# Altium project PCB_Personal_Gif.PrjPcb (part 1 of 2)
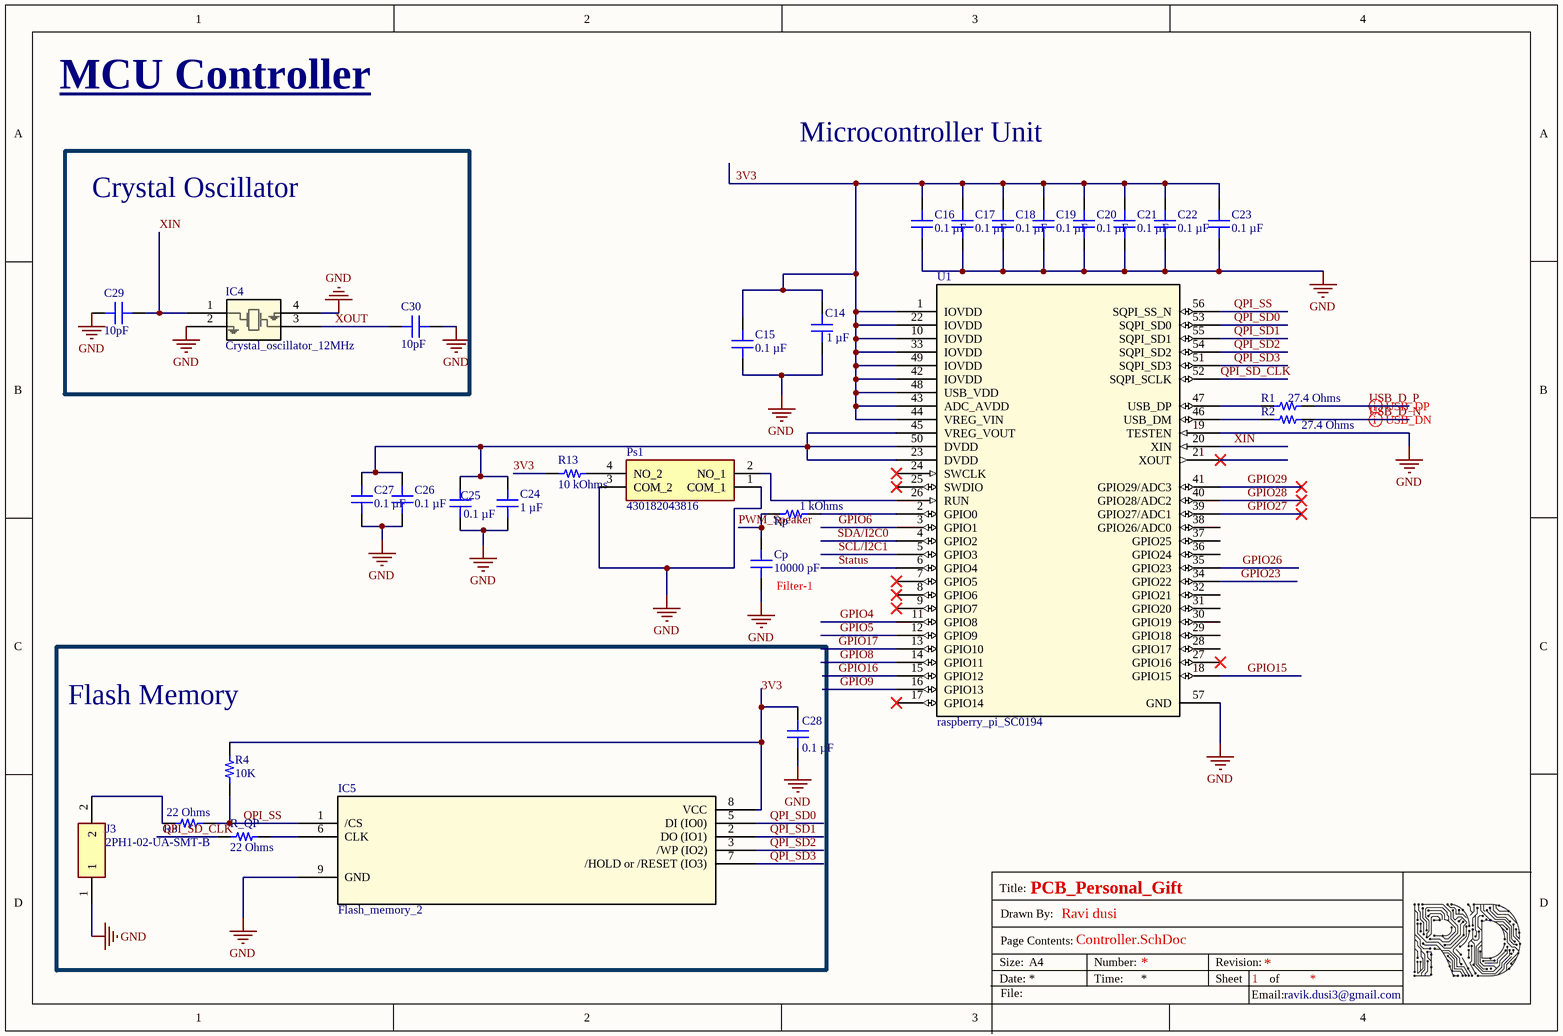
[diagram p0: Controller.SchDoc]
4 sheets, 130 parts. Net scope: global (net labels, ports and power ports of the same name join across sheets).
Board file: GIF_PCB.PcbDoc
Sheets:
  Controller.SchDoc
  Peripherals_1.SchDoc
  Peripherals_2.SchDoc
  Power_Architecture.SchDoc

## Sheet Controller.SchDoc: PCB_Personal_Gift
size A4; Author: Ravi kumar dusi; DrawnBy: Ravi dusi; Engineer: Ravi dusi; SheetNumber: 1; SheetTotal: 4

### Parts
C14  1 µF  [CAP 0402_1005]
C15  0.1 µF  [CAP 0402_1005]
C16  0.1 µF  [CAP 0402_1005]
C17  0.1 µF  [CAP 0402_1005]
C18  0.1 µF  [CAP 0402_1005]
C19  0.1 µF  [CAP 0402_1005]
C20  0.1 µF  [CAP 0402_1005]
C21  0.1 µF  [CAP 0402_1005]
C22  0.1 µF  [CAP 0402_1005]
C23  0.1 µF  [CAP 0402_1005]
C24  1 µF  [CAP 0402_1005]
C25  0.1 µF  [CAP 0402_1005]
C26  0.1 µF  [CAP 0402_1005]
C27  0.1 µF  [CAP 0402_1005]
C28  0.1 µF  [CAP 0402_1005]
C29  10pF  [CAP 0402_1005]
C30  10pF  [CAP 0402_1005]
Cp  10000 pF  [CAP 0402_1005]
IC4  Crystal_oscillator_12MHz  [ABM8-272-T3_ABR]
IC5  Flash_memory_2  [SON127P610X510X80-8N430X340]
J3  2PH1-02-UA-SMT-B  [2PH102UASMTB]
Ps1  430182043816  [430182043816]
R1  27.4 Ohms  [RES 0402_1005]
R2  27.4 Ohms  [RES 0402_1005]
R3  22 Ohms  [RES 0402_1005]
R4  10K  [RES 0402_1005]
R13  10 kOhms  [RES 0402_1005]
R_QP  22 Ohms  [RES 0402_1005]
Rp  1 kOhms  [YAGEO RES 0402_1005]
U1  raspberry_pi_SC0194  [QFN56_7X7_RPI]

### Blocks framed on the sheet
Crystal Oscillator: C29 C30 IC4
Flash Memory: C28 IC5 J3 R3 R4 R_QP

### Nets
GND: C14.1 C15.1 C16.1 C17.1 C18.1 C19.1 C20.1 C21.1 C22.1 C23.1 C24.1 C25.1 C26.1 C27.1 C28.1 C29.1 C30.2 Cp.1 IC4.2 IC4.4 IC5.9(GND) J3.1 Ps1.1(COM_1) Ps1.3(COM_2) U1.19(TESTEN) U1.57(GND)
3V3: C14.2 C15.2 C16.2 C17.2 C18.2 C19.2 C20.2 C21.2 C22.2 C23.2 C28.2 IC5.8(VCC) R4.2 R13.1 U1.1(IOVDD) U1.10(IOVDD) U1.22(IOVDD) U1.33(IOVDD) U1.42(IOVDD) U1.43(ADC_AVDD) U1.44(VREG_VIN) U1.48(USB_VDD) U1.49(IOVDD)
GPIO4: U1.11(GPIO8)
GPIO5: U1.12(GPIO9)
GPIO6: U1.3(GPIO1)
GPIO8: U1.14(GPIO11)
GPIO9: U1.16(GPIO13)
GPIO15: U1.18(GPIO15)
GPIO16: U1.15(GPIO12)
GPIO17: U1.13(GPIO10)
GPIO23: U1.34(GPIO22)
GPIO26: U1.35(GPIO23)
GPIO27: U1.39(GPIO27/ADC1)
GPIO28: U1.40(GPIO28/ADC2)
GPIO29: U1.41(GPIO29/ADC3)
PWM_Speaker: Cp.2 Rp.1
QPI_SD0: IC5.5(DI_(IO0)) U1.53(SQPI_SD0)
QPI_SD1: IC5.2(DO_(IO1)) U1.55(SQPI_SD1)
QPI_SD2: IC5.3(/WP_(IO2)) U1.54(SQPI_SD2)
QPI_SD3: IC5.7(/HOLD_or_/RESET_(IO3)) U1.51(SQPI_SD3)
QPI_SD_CLK: R_QP.1 U1.52(SQPI_SCLK)
QPI_SS: IC5.1(/CS) R3.2 R4.1 U1.56(SQPI_SS_N)
SCL/I2C1: U1.5(GPIO3)
SDA/I2C0: U1.4(GPIO2)
Status: U1.6(GPIO4)
USB_D_N: R2.2
USB_D_P: R1.2
XIN: C29.2 IC4.1 U1.20(XIN)
XOUT: C30.1 IC4.3
NetC24_2: C24.2 C25.2 C26.2 C27.2 U1.23(DVDD) U1.45(VREG_VOUT) U1.50(DVDD)
NetIC5_6: IC5.6(CLK) R_QP.2
NetJ3_2: J3.2 R3.1
NetPs1_2: Ps1.2(NO_1) U1.26(RUN)
NetPs1_4: Ps1.4(NO_2) R13.2
NetR1_1: R1.1 U1.47(USB_DP)
NetR2_1: R2.1 U1.46(USB_DM)
NetRp_2: Rp.2 U1.2(GPIO0)

Not connected (* = marked no-connect by the designer): U1 7(GPIO5)* 8(GPIO6)* 9(GPIO7)* 17(GPIO14)* 21(XOUT)* 24(SWCLK)* 25(SWDIO)* 27(GPIO16)* 28(GPIO17) 29(GPIO18) 30(GPIO19) 31(GPIO20) 32(GPIO21) 36(GPIO24) 37(GPIO25) 38(GPIO26/ADC0)

### Layout directives
differential pair: USB_D_N, USB_D_P

### Notes on the sheet
- MCU Controller
- Microcontroller Unit
- (near Cp) Filter-1
- Title:
- Drawn By:
- Size:
- Date:
- File:
- Page Contents:
- A4
- Number:
- Time:
- Revision:
- Sheet
- Email:
- of
- ravik.dusi3@gmail.com

### Library data of the parts
C14 C24 = GRM155C71A105KE11D: CAP CER 1UF 10V X7S 0402; manufacturer: Murata Electronics; Tolerance: ±10%; Part Number: GRM155C71A105KE11D; Value: 1 µF; Applications: General Purpose; Capacitance: 1 µF; componentlink1description: Datasheet; componentlink1url: https://search.murata.co.jp/Ceramy/image/img/A01X/G101/ENG/GRM155C71A105KE11-01.pdf; componentlink2description: DigiKey Link; componentlink2url: https://www.digikey.com/en/products/detail/murata-electronics/GRM155C71A105KE11D/6606086; Device Package: 0402 (1005 Metric); lastupdated: 09/02/2024 20:04:38; Lifecycle Status: Active; Minimum Order: 1; Mounting Type: Surface Mount, MLCC; Operating Temperature: -55°C ~ 125°C; Package / Case: 0402 (1005 Metric); packaging: TapeAndReel; partid: 1749; Part Status: Active; price: 0.01; series: GRM; Size / Dimension: 0.039" L x 0.020" W (1.00mm x 0.50mm); Supplier 1: DigiKey; Supplier Part Number 1: 490-14457-1-ND; Temperature Coefficient: X7S; Thickness (Max): 0.024" (0.60mm); Voltage - Rated: 10V
C15-C23 C25-C28 = C0402C104K4RECAUTO: CAP CER 0402 0.1UF 16V X7R 10%; manufacturer: KEMET; Part Number: C0402C104K4RECAUTO; Value: 0.1 µF; Applications: Automotive, ESD Protection; Capacitance: 0.1 µF; componentlink1description: Datasheet; componentlink1url: https://api.kemet.com/component-edge/download/datasheet/C0402C104K4RECAUTO.pdf; componentlink2description: DigiKey Link; componentlink2url: https://www.digikey.com/en/products/detail/kemet/C0402C104K4RECAUTO/8563695; Device Package: 0402 (1005 Metric); lastupdated: 09/02/2024 20:04:38; Lifecycle Status: Active; Minimum Order: 1; Mounting Type: Surface Mount, MLCC; Operating Temperature: -55°C ~ 125°C; Package / Case: 0402 (1005 Metric); packaging: TapeAndReel; partid: 1731; Part Status: Active; price: 0.01; Ratings: AEC-Q200; series: ESD SMD Auto X7R; Size / Dimension: 0.039" L x 0.020" W (1.00mm x 0.50mm); Supplier 1: DigiKey; Supplier Part Number 1: 399-17167-1-ND; Temperature Coefficient: X7R; Thickness (Max): 0.022" (0.55mm); Tolerance: ±10%; Voltage - Rated: 16V
C29 C30 = 04025U100JAT2A: CAP CER 10PF 50V C0G/NP0 0402; manufacturer: AVX Corporation; Temperature Coefficient: C0G, NP0; Tolerance: ±5%; Part Number: 04025U100JAT2A; Value: 10pF; Applications: RF, Microwave, High Frequency; Capacitance: 10pF; componentlink1description: Datasheet; componentlink1url: http://datasheets.avx.com/U-Series.pdf; componentlink2description: DigiKey Link; componentlink2url: http://digikey.com/product-detail/en/avx-corporation/04025U100JAT2A/478-3831-1-ND/1118493; Device Package: 0402 (1005 Metric); Features: Ultra Low ESR; lastupdated: 08/02/2022 12:26:58; Lifecycle Status: Active; Minimum Order: 1; Mounting Type: Surface Mount, MLCC; Operating Temperature: -55°C ~ 125°C; Package / Case: 0402 (1005 Metric); packaging: TapeAndReel; partid: 1802; Part Status: Active; price: 0.02; series: U; Size / Dimension: 0.039" L x 0.020" W (1.00mm x 0.50mm); Supplier 1: DigiKey; Supplier Part Number 1: 478-3831-1-ND; Thickness (Max): 0.024" (0.60mm); Voltage - Rated: 50V
Cp = C0402C103M5RECAUTO: CAP CER 0402 10NF 50V X7R 20%; manufacturer: KEMET; Part Number: C0402C103M5RECAUTO; Capacitance: 10000 pF; Applications: Automotive, ESD Protection; componentlink1description: Datasheet; componentlink1url: https://api.kemet.com/component-edge/download/datasheet/C0402C103M5RECAUTO.pdf; componentlink2description: DigiKey Link; componentlink2url: https://www.digikey.com/en/products/detail/kemet/C0402C103M5RECAUTO/8646509; Device Package: 0402 (1005 Metric); lastupdated: 09-02-2024 20:04:13; Lifecycle Status: Active; Minimum Order: 1; Mounting Type: Surface Mount, MLCC; Operating Temperature: -55°C ~ 125°C; Package / Case: 0402 (1005 Metric); packaging: TapeAndReel; partid: 33125; Part Status: Active; price: 0.01; Ratings: AEC-Q200; series: ESD SMD Auto X7R; Size / Dimension: 0.039" L x 0.020" W (1.00mm x 0.50mm); Supplier 1: DigiKey; Supplier Part Number 1: 399-C0402C103M5RECAUTOCT-ND; Temperature Coefficient: X7R; Thickness (Max): 0.022" (0.55mm); Tolerance: ±20%; value: 10000 pF; Voltage - Rated: 50V
IC5 = Flash_memory_2: FLASH - NOR Memory IC 128Mb (16M x 8) SPI - Quad I/O, QPI, DTR 133 MHz 8-SOIC
J3 = 2PH1-02-UA-SMT-B: Connector; Manufacturer_Name: Adam Tech; Datasheet Link: https://datasheet.datasheetarchive.com/originals/distributors/Datasheets_SAMA/9f680ad2dadff3b0200287e04b69ceab.pdf; Height: 6.7mm; Manufacturer_Part_Number: 2PH1-02-UA-SMT-B; Mouser Part Number: 737-2PH1-02-UA-SMT-B; Mouser Price/Stock: https://www.mouser.co.uk/ProductDetail/Adam-Tech/2PH1-02-UA-SMT-B?qs=HoCaDK9Nz5ctaJuvgnyAoA%3D%3D; Arrow Part Number: 2PH1-02-UA-SMT-B; Arrow Price/Stock: https://www.arrow.com/en/products/2ph1-02-ua-smt-b/adam-tech?utm_currency=USD&region=nac
Ps1 = 430182043816: Switch; Manufacturer_Name: Wurth Elektronik; Datasheet Link: https://www.we-online.com/catalog/datasheet/430182043816.pdf; Height: 4.3mm; Manufacturer_Part_Number: 430182043816; Mouser Part Number: 710-430182043816; Mouser Price/Stock: https://www.mouser.co.uk/ProductDetail/Wurth-Elektronik/430182043816?qs=wr8lucFkNMVm%252BwK7rSM84A%3D%3D
R1 R2 = RC0402FR-0727R4L: RES 27.4 OHM 1% 1/16W 0402; Manufacturer: Yageo; Power (Watts): 0.063W, 1/16W; Temperature Coefficient: ±100ppm/°C; Part Number: RC0402FR-0727R4L; Value: 27.4 Ohms; ComponentLink1Description: Datasheet; ComponentLink1URL: https://www.yageo.com/upload/media/product/productsearch/datasheet/rchip/PYu-RC_Group_51_RoHS_L_10.pdf; ComponentLink2Description: DigiKey Link; ComponentLink2URL: https://www.digikey.com/en/products/detail/yageo/RC0402FR-0727R4L/5280945; Composition: Thick Film; Device Package: 0402 (1005 Metric); Features: Moisture Resistant; Height - Seated (Max): 0.016" (0.40mm); LastUpdated: 09/02/2024 20:30:23; Lifecycle Status: Active; Minimum Order: 1; Number of Terminations: 2; Operating Temperature: -55°C ~ 155°C; Package / Case: 0402 (1005 Metric); Packaging: CutTape; PartId: 2632; Part Status: Active; Price: 0.01; Resistance: 27.4 Ohms; Series: RC_L; Size / Dimension: 0.039" L x 0.020" W (1.00mm x 0.50mm); Supplier 1: DigiKey; Supplier Part Number 1: YAG3085CT-ND; Supplier Device Package: 0402; Tolerance: ±1%
R3 R_QP = RR0510R-220-D: RES SMD 22 OHM 0.5% 1/16W 0402; Manufacturer: Susumu; Power (Watts): 0.063W, 1/16W; Temperature Coefficient: ±100ppm/°C; Part Number: RR0510R-220-D; Value: 22 Ohms; ComponentLink1Description: Datasheet; ComponentLink1URL: http://www.susumu.co.jp/common/pdf/n_catalog_partition05_en.pdf; ComponentLink2Description: DigiKey Link; ComponentLink2URL: https://www.digikey.com/en/products/detail/susumu/RR0510R-220-D/567231; Composition: Thin Film; Device Package: 0402 (1005 Metric); Height - Seated (Max): 0.016" (0.40mm); LastUpdated: 09-02-2024 20:30:21; Lifecycle Status: Active; Minimum Order: 1; Number of Terminations: 2; Operating Temperature: -55°C ~ 125°C; Package / Case: 0402 (1005 Metric); Packaging: TapeAndReel; PartId: 3266; Part Status: Active; Price: 0.01; Resistance: 22 Ohms; Series: RR; Size / Dimension: 0.039" L x 0.020" W (1.00mm x 0.50mm); Supplier 1: DigiKey; Supplier Part Number 1: RR05R22DCT-ND; Tolerance: ±0.5%
R4 = RP73PF1E10KBTD: RES 10K OHM 0.1% 1/10W 0402; Manufacturer: TE Connectivity Passive Product; Power (Watts): 0.1W, 1/10W; Resistance: 10 kOhms; Temperature Coefficient: ±25ppm/°C; Part Number: RP73PF1E10KBTD; Value: 10K; ComponentLink1Description: Datasheet; ComponentLink1URL: https://www.te.com/commerce/DocumentDelivery/DDEController?Action=srchrtrv&DocNm=1773272&DocType=DS&DocLang=English; ComponentLink2Description: DigiKey Link; ComponentLink2URL: https://www.digikey.com/en/products/detail/te-connectivity-passive-product/RP73PF1E10KBTD/8260957; Composition: Thin Film; Device Package: 0402 (1005 Metric); Height - Seated (Max): 0.014" (0.35mm); LastUpdated: 09/02/2024 20:30:24; Lifecycle Status: Active; Minimum Order: 1; Number of Terminations: 2; Operating Temperature: -55°C ~ 155°C; Package / Case: 0402 (1005 Metric); Packaging: TapeAndReel; PartId: 2434; Part Status: Active; Price: 0.08; Series: RP73, Holsworthy; Size / Dimension: 0.039" L x 0.020" W (1.00mm x 0.50mm); Supplier 1: DigiKey; Supplier Part Number 1: A127415CT-ND; Supplier Device Package: 0402; Tolerance: ±0.1%
R13 = RP73PF1E10KBTD: RES 10K OHM 0.1% 1/10W 0402; Manufacturer: TE Connectivity Passive Product; Power (Watts): 0.1W, 1/10W; Temperature Coefficient: ±25ppm/°C; Part Number: RP73PF1E10KBTD; Value: 10 kOhms; ComponentLink1Description: Datasheet; ComponentLink1URL: https://www.te.com/commerce/DocumentDelivery/DDEController?Action=srchrtrv&DocNm=1773272&DocType=DS&DocLang=English; ComponentLink2Description: DigiKey Link; ComponentLink2URL: https://www.digikey.com/en/products/detail/te-connectivity-passive-product/RP73PF1E10KBTD/8260957; Composition: Thin Film; Device Package: 0402 (1005 Metric); Height - Seated (Max): 0.014" (0.35mm); LastUpdated: 09/02/2024 20:30:24; Lifecycle Status: Active; Minimum Order: 1; Number of Terminations: 2; Operating Temperature: -55°C ~ 155°C; Package / Case: 0402 (1005 Metric); Packaging: TapeAndReel; PartId: 2434; Part Status: Active; Price: 0.08; Resistance: 10 kOhms; Series: RP73, Holsworthy; Size / Dimension: 0.039" L x 0.020" W (1.00mm x 0.50mm); Supplier 1: DigiKey; Supplier Part Number 1: A127415CT-ND; Supplier Device Package: 0402; Tolerance: ±0.1%
Rp = AT0402BRD071KL: RES SMD 1K OHM 0.1% 1/16W 0402; Manufacturer: Yageo; Power (Watts): 0.063W, 1/16W; Temperature Coefficient: ±25ppm/°C; Part Number: AT0402BRD071KL; Value: 1 kOhms; ComponentLink1Description: Datasheet; ComponentLink1URL: http://www.yageo.com/documents/recent/PYu-AT_51_RoHS_L_5.pdf; ComponentLink2Description: DigiKey Link; ComponentLink2URL: https://www.digikey.com/en/products/detail/yageo/AT0402BRD071KL/5138607; Composition: Thin Film; Device Package: 0402 (1005 Metric); Features: Anti-Sulfur, Automotive AEC-Q200, Moisture Resistant; Height - Seated (Max): 0.014" (0.35mm); LastUpdated: 31-08-2025 15:04:18; Lifecycle Status: Active; Minimum Order: 1; Number of Terminations: 2; Operating Temperature: -55°C ~ 155°C; Package / Case: 0402 (1005 Metric); Packaging: TapeAndReel; PartId: 2462; Part Status: Active; Price: 0.09; Ratings: AEC-Q200; Resistance: 1 kOhms; Series: AT; Size / Dimension: 0.039" L x 0.020" W (1.00mm x 0.50mm); Supplier 1: DigiKey; Supplier Part Number 1: YAG2088CT-ND; Supplier Device Package: 0402; Tolerance: ±0.1%
U1 = raspberry_pi_SC0194: rp2040 rapberri Pi Microcontroller

## Sheet Peripherals_1.SchDoc: PCB_Personal_Gif
size A4; DrawnBy: Ravi dusi; SheetNumber: 2; SheetTotal: 4
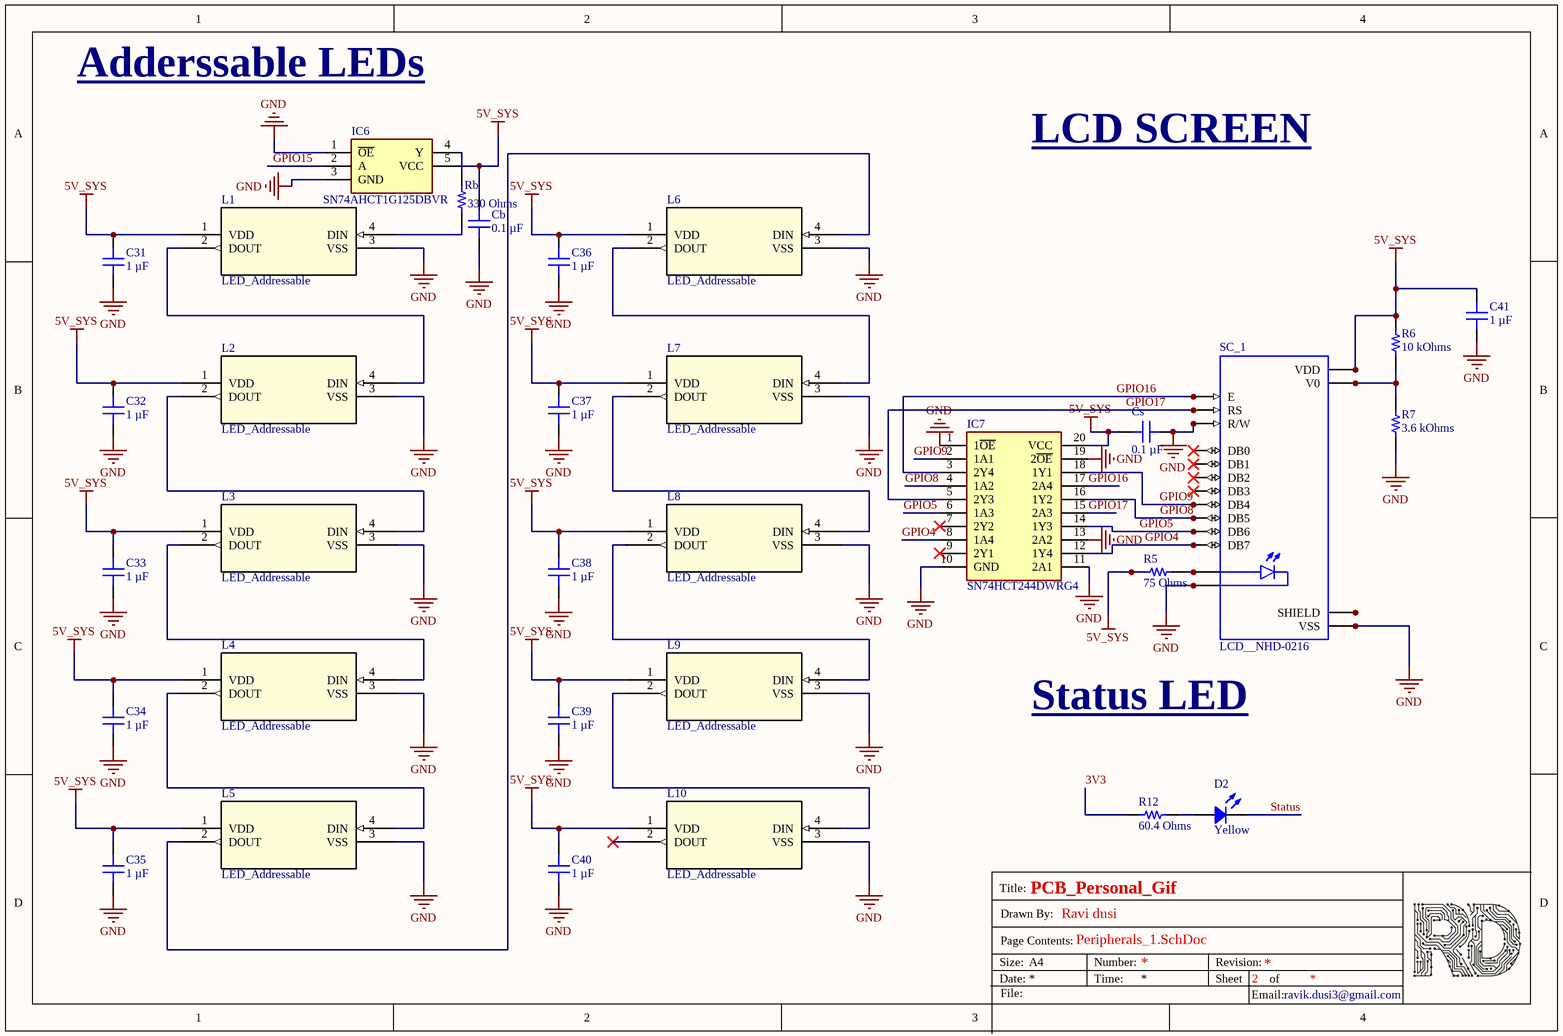
[diagram p1: Peripherals_1.SchDoc]

### Parts
C31  1 µF  [CAP 0402_1005]
C32  1 µF  [CAP 0402_1005]
C33  1 µF  [CAP 0402_1005]
C34  1 µF  [CAP 0402_1005]
C35  1 µF  [CAP 0402_1005]
C36  1 µF  [CAP 0402_1005]
C37  1 µF  [CAP 0402_1005]
C38  1 µF  [CAP 0402_1005]
C39  1 µF  [CAP 0402_1005]
C40  1 µF  [CAP 0402_1005]
C41  1 µF  [CAP 0402_1005]
Cb  0.1 µF  [CAP 0402_1005]
Cs  0.1 µF  [CAP 0402_1005]
D2  Yellow  [LED 1206_3216 YELLOW]
IC6  SN74AHCT1G125DBVR  [SOT95P280X145-5N]
IC7  SN74HCT244DWRG4  [SOIC127P1030X265-20N]
L1  LED_Addressable  [COM-16347_SPK]
L2  LED_Addressable  [COM-16347_SPK]
L3  LED_Addressable  [COM-16347_SPK]
L4  LED_Addressable  [COM-16347_SPK]
L5  LED_Addressable  [COM-16347_SPK]
L6  LED_Addressable  [COM-16347_SPK]
L7  LED_Addressable  [COM-16347_SPK]
L8  LED_Addressable  [COM-16347_SPK]
L9  LED_Addressable  [COM-16347_SPK]
L10  LED_Addressable  [COM-16347_SPK]
R5  75 Ohms  [RES 0402_1005]
R6  10 kOhms  [RES 0402_1005]
R7  3.6 kOhms  [RES 0402_1005]
R12  60.4 Ohms  [RES 0402_1005]
Rb  330 Ohms  [RES 0402_1005]
SC_1  LCD__NHD-0216  [NHD_NHD-0216K1Z-NSW-BBW-L]

### Nets
5V_SYS: C31.2 C32.2 C33.2 C34.2 C35.2 C36.2 C37.2 C38.2 C39.2 C40.2 C41.2 Cb.2 Cs.1 IC6.5(VCC) IC7.20(VCC) L1.1(VDD) L2.1(VDD) L3.1(VDD) L4.1(VDD) L5.1(VDD) L6.1(VDD) L7.1(VDD) L8.1(VDD) L9.1(VDD) L10.1(VDD) R5.1 R6.2 SC_1.2_1(VDD) SC_1.2_2(VDD)
GND: C31.1 C32.1 C33.1 C34.1 C35.1 C36.1 C37.1 C38.1 C39.1 C40.1 C41.1 Cb.1 Cs.2 IC6.1(~{OE}) IC6.3(GND) IC7.1(1~{OE}) IC7.10(GND) IC7.11(2A1) IC7.13(2A2) IC7.19(2~{OE}) L1.3(VSS) L2.3(VSS) L3.3(VSS) L4.3(VSS) L5.3(VSS) L6.3(VSS) L7.3(VSS) L8.3(VSS) L9.3(VSS) L10.3(VSS) R7.1 SC_1.1_1(VSS) SC_1.1_2(VSS) SC_1.5_1(R/W) SC_1.5_2(R/W) SC_1.16_1(LED-) SC_1.16_2(LED-)
3V3: R12.1
GPIO4: IC7.8(1A4) IC7.12(1Y4) SC_1.14_1(DB7) SC_1.14_2(DB7)
GPIO5: IC7.6(1A3) IC7.14(1Y3) SC_1.13_1(DB6) SC_1.13_2(DB6)
GPIO8: IC7.4(1A2) IC7.16(1Y2) SC_1.12_1(DB5) SC_1.12_2(DB5)
GPIO9: IC7.2(1A1) IC7.18(1Y1) SC_1.11_1(DB4) SC_1.11_2(DB4)
GPIO15: IC6.2(A)
GPIO16: IC7.3(2Y4) IC7.17(2A4) SC_1.6_1(E) SC_1.6_2(E)
GPIO17: IC7.5(2Y3) IC7.15(2A3) SC_1.4_1(RS) SC_1.4_2(RS)
Status: D2.2
NetD2_1: D2.1 R12.2
NetIC6_4: IC6.4(Y) Rb.2
NetL1_2: L1.2(DOUT) L2.4(DIN)
NetL1_4: L1.4(DIN) Rb.1
NetL2_2: L2.2(DOUT) L3.4(DIN)
NetL3_2: L3.2(DOUT) L4.4(DIN)
NetL4_2: L4.2(DOUT) L5.4(DIN)
NetL5_2: L5.2(DOUT) L6.4(DIN)
NetL6_2: L6.2(DOUT) L7.4(DIN)
NetL7_2: L7.2(DOUT) L8.4(DIN)
NetL8_2: L8.2(DOUT) L9.4(DIN)
NetL9_2: L9.2(DOUT) L10.4(DIN)
NetR5_2: R5.2 SC_1.15_1(LED+) SC_1.15_2(LED+)
NetR6_1: R6.1 R7.2 SC_1.3_1(V0) SC_1.3_2(V0)
NetSC_1_7_1: SC_1.7_1(DB0) SC_1.7_2(DB0)
NetSC_1_8_1: SC_1.8_1(DB1) SC_1.8_2(DB1)
NetSC_1_9_1: SC_1.9_1(DB2) SC_1.9_2(DB2)
NetSC_1_10_1: SC_1.10_1(DB3) SC_1.10_2(DB3)
NetSC_1_S1: SC_1.S1(SHIELD) SC_1.S2(SHIELD) SC_1.S3(SHIELD) SC_1.S4(SHIELD)

Not connected (* = marked no-connect by the designer): IC7 7(2Y2)* 9(2Y1)*; L10 2(DOUT)*

### Notes on the sheet
- Adderssable LEDs
- LCD SCREEN
- (near SC_1) Status LED
- Title:
- Drawn By:
- Size:
- Date:
- File:
- Page Contents:
- A4
- Number:
- Time:
- Revision:
- Sheet
- Email:
- of
- ravik.dusi3@gmail.com

### Library data of the parts
C31-C41 = GRM155C71A105KE11D: as C14 on sheet Controller; Part Number: GRM155C71A105KE11D; Value: 1 µF; Applications: General Purpose; Capacitance: 1 µF; componentlink1description: Datasheet; componentlink1url: https://search.murata.co.jp/Ceramy/image/img/A01X/G101/ENG/GRM155C71A105KE11-01.pdf; componentlink2description: DigiKey Link; componentlink2url: https://www.digikey.com/en/products/detail/murata-electronics/GRM155C71A105KE11D/6606086; Device Package: 0402 (1005 Metric); lastupdated: 09/02/2024 20:04:38; Lifecycle Status: Active; Minimum Order: 1; Mounting Type: Surface Mount, MLCC; Operating Temperature: -55°C ~ 125°C; Package / Case: 0402 (1005 Metric); packaging: TapeAndReel; partid: 1749; Part Status: Active; price: 0.01; series: GRM; Size / Dimension: 0.039" L x 0.020" W (1.00mm x 0.50mm); Supplier 1: DigiKey; Supplier Part Number 1: 490-14457-1-ND; Temperature Coefficient: X7S; Thickness (Max): 0.024" (0.60mm); Voltage - Rated: 10V
Cb Cs = C0402C104K4RECAUTO: as C15 on sheet Controller; Part Number: C0402C104K4RECAUTO; Capacitance: 0.1 µF; Applications: Automotive, ESD Protection; componentlink1description: Datasheet; componentlink1url: https://api.kemet.com/component-edge/download/datasheet/C0402C104K4RECAUTO.pdf; componentlink2description: DigiKey Link; componentlink2url: https://www.digikey.com/en/products/detail/kemet/C0402C104K4RECAUTO/8563695; Device Package: 0402 (1005 Metric); lastupdated: 09-02-2024 20:04:38; Lifecycle Status: Active; Minimum Order: 1; Mounting Type: Surface Mount, MLCC; Operating Temperature: -55°C ~ 125°C; Package / Case: 0402 (1005 Metric); packaging: TapeAndReel; partid: 1731; Part Status: Active; price: 0.01; Ratings: AEC-Q200; series: ESD SMD Auto X7R; Size / Dimension: 0.039" L x 0.020" W (1.00mm x 0.50mm); Supplier 1: DigiKey; Supplier Part Number 1: 399-17167-1-ND; Temperature Coefficient: X7R; Thickness (Max): 0.022" (0.55mm); Tolerance: ±10%; value: 0.1 µF; Voltage - Rated: 16V
D2 = 5990240007F: LED YELLOW 1206 SMD; Manufacturer: Dialight; Configuration: Standard; Current - Test: 20mA; Lens Color: 0.80mm; Lens Size: 2.00mm x 1.60mm; Lens Style: Rectangle with Flat Top; Millicandela Rating: 126mcd; Viewing Angle: 140°; Voltage - Forward (Vf) (Typ): 2.1V; Wavelength - Dominant: 590nm; Part Number: 5990240007F; Color: Yellow; ComponentLink1Description: Datasheet; ComponentLink1URL: http://www.dialightsignalsandcomponents.com/Assets/Brochures_And_Catalogs/Indication/CBI_SMD_new/Dialight_CBI_data_599-1206_Apr2018.pdf; ComponentLink2Description: DigiKey Link; ComponentLink2URL: https://www.digikey.com/en/products/detail/dialight/5990240007F/9385418; Device Package: 1206 (3216 Metric); Height (Max): 0.80mm; LastUpdated: 03/06/2024 20:01:38; Lifecycle Status: Active; Minimum Order: 1; Mounting Type: Surface Mount; Package / Case: 1206 (3216 Metric); Packaging: TapeAndReel; PartId: 1; Part Status: Active; Price: 0.04; Series: 599; Size / Dimension: 3.20mm L x 1.60mm W; Supplier 1: DigiKey; Supplier Part Number 1: 350-4363-1-ND; Supplier Device Package: 1206; Value: Yellow
IC6 = SN74AHCT1G125DBVR: Integrated Circuit; Manufacturer_Name: Texas Instruments; Datasheet Link: http://www.ti.com/lit/ds/symlink/sn74ahct1g125.pdf; Height: 1.45mm; Manufacturer_Part_Number: SN74AHCT1G125DBVR; Mouser Part Number: 595-SNAHCT1G125DBVR; Mouser Price/Stock: https://www.mouser.co.uk/ProductDetail/Texas-Instruments/SN74AHCT1G125DBVR?qs=N6WZOzgtpqVaVW8Lh%252BgevA%3D%3D; Arrow Part Number: SN74AHCT1G125DBVR; Arrow Price/Stock: https://www.arrow.com/en/products/sn74ahct1g125dbvr/texas-instruments?utm_currency=USD&region=nac
IC7 = SN74HCT244DWRG4: Integrated Circuit; Manufacturer_Name: Texas Instruments; Datasheet Link: https://www.ti.com/general/docs/suppproductinfo.tsp?distId=10&gotoUrl=https%3A%2F%2Fwww.ti.com%2Flit%2Fgpn%2Fsn74hct244; Height: 2.65mm; Manufacturer_Part_Number: SN74HCT244DWRG4; Mouser Part Number: 595-SN74HCT244DWRG4; Mouser Price/Stock: https://www.mouser.co.uk/ProductDetail/Texas-Instruments/SN74HCT244DWRG4?qs=XQzc%252BbSrk5%252BkrjJHsjpLYg%3D%3D; Arrow Part Number: SN74HCT244DWRG4; Arrow Price/Stock: https://www.arrow.com/en/products/sn74hct244dwrg4/texas-instruments?utm_currency=USD&region=nac
R5 = ERJ-2GEJ750X: RES SMD 75 OHM 5% 1/10W 0402; Manufacturer: Panasonic Electronic Components; Power (Watts): 0.1W, 1/10W; Temperature Coefficient: ±200ppm/°C; Part Number: ERJ-2GEJ750X; Value: 75 Ohms; ComponentLink1Description: Datasheet; ComponentLink1URL: https://b2b-api.panasonic.eu/file_stream/pids/fileversion/1242; ComponentLink2Description: DigiKey Link; ComponentLink2URL: https://www.digikey.com/en/products/detail/panasonic-electronic-components/ERJ-2GEJ750X/147072; Composition: Thick Film; Device Package: 0402 (1005 Metric); Features: Automotive AEC-Q200; Height - Seated (Max): 0.016" (0.40mm); LastUpdated: 09/02/2024 20:30:20; Lifecycle Status: Active; Minimum Order: 1; Number of Terminations: 2; Operating Temperature: -55°C ~ 155°C; Package / Case: 0402 (1005 Metric); Packaging: CutTape; PartId: 3537; Part Status: Active; Price: 0.01; Ratings: AEC-Q200; Resistance: 75 Ohms; Series: ERJ-2G; Size / Dimension: 0.039" L x 0.020" W (1.00mm x 0.50mm); Supplier 1: DigiKey; Supplier Part Number 1: P75JCT-ND; Supplier Device Package: 0402; Tolerance: ±5%
R6 = RP73PF1E10KBTD: as R13 on sheet Controller; Part Number: RP73PF1E10KBTD; Value: 10 kOhms; ComponentLink1Description: Datasheet; ComponentLink1URL: https://www.te.com/commerce/DocumentDelivery/DDEController?Action=srchrtrv&DocNm=1773272&DocType=DS&DocLang=English; ComponentLink2Description: DigiKey Link; ComponentLink2URL: https://www.digikey.com/en/products/detail/te-connectivity-passive-product/RP73PF1E10KBTD/8260957; Composition: Thin Film; Device Package: 0402 (1005 Metric); Height - Seated (Max): 0.014" (0.35mm); LastUpdated: 09/02/2024 20:30:24; Lifecycle Status: Active; Minimum Order: 1; Number of Terminations: 2; Operating Temperature: -55°C ~ 155°C; Package / Case: 0402 (1005 Metric); Packaging: TapeAndReel; PartId: 2434; Part Status: Active; Price: 0.08; Resistance: 10 kOhms; Series: RP73, Holsworthy; Size / Dimension: 0.039" L x 0.020" W (1.00mm x 0.50mm); Supplier 1: DigiKey; Supplier Part Number 1: A127415CT-ND; Supplier Device Package: 0402; Tolerance: ±0.1%
R7 = RC0402FR-073K6L: RES 3.6K OHM 1% 1/16W 0402; Manufacturer: Yageo; Power (Watts): 0.063W, 1/16W; Temperature Coefficient: ±100ppm/°C; Part Number: RC0402FR-073K6L; Value: 3.6 kOhms; ComponentLink1Description: Datasheet; ComponentLink1URL: https://www.yageo.com/upload/media/product/productsearch/datasheet/rchip/PYu-RC_Group_51_RoHS_L_10.pdf; ComponentLink2Description: DigiKey Link; ComponentLink2URL: https://www.digikey.com/en/products/detail/yageo/RC0402FR-073K6L/2827641; Composition: Thick Film; Device Package: 0402 (1005 Metric); Features: Moisture Resistant; Height - Seated (Max): 0.016" (0.40mm); LastUpdated: 09/02/2024 20:30:23; Lifecycle Status: Active; Minimum Order: 1; Number of Terminations: 2; Operating Temperature: -55°C ~ 155°C; Package / Case: 0402 (1005 Metric); Packaging: CutTape; PartId: 2730; Part Status: Active; Price: 0.01; Resistance: 3.6 kOhms; Series: RC_L; Size / Dimension: 0.039" L x 0.020" W (1.00mm x 0.50mm); Supplier 1: DigiKey; Supplier Part Number 1: 311-3.6KLRCT-ND; Supplier Device Package: 0402; Tolerance: ±1%
R12 = RT0402BRD0760R4L: RES SMD 60.4 OHM 0.1% 1/16W 0402; Manufacturer: Yageo; Power (Watts): 0.063W, 1/16W; Temperature Coefficient: ±25ppm/°C; Part Number: RT0402BRD0760R4L; Value: 60.4 Ohms; ComponentLink1Description: Datasheet; ComponentLink1URL: https://www.yageo.com/upload/media/product/productsearch/datasheet/rchip/PYu-RT_1-to-0.01_RoHS_L_11.pdf; ComponentLink2Description: DigiKey Link; ComponentLink2URL: https://www.digikey.com/en/products/detail/yageo/RT0402BRD0760R4L/1069349; Composition: Thin Film; Device Package: 0402 (1005 Metric); Height - Seated (Max): 0.014" (0.35mm); LastUpdated: 09/02/2024 20:30:16; Lifecycle Status: Active; Minimum Order: 1; Number of Terminations: 2; Operating Temperature: -55°C ~ 155°C; Package / Case: 0402 (1005 Metric); Packaging: TapeAndReel; PartId: 4533; Part Status: Active; Price: 0.04; Resistance: 60.4 Ohms; Series: RT; Size / Dimension: 0.039" L x 0.020" W (1.00mm x 0.50mm); Supplier 1: DigiKey; Supplier Part Number 1: YAG4293CT-ND; Supplier Device Package: 0402; Tolerance: ±0.1%
Rb = CPF0402B330RE1: RES SMD 330 OHM 0.1% 1/16W 0402; Manufacturer: TE Connectivity Passive Product; Power (Watts): 0.063W, 1/16W; Temperature Coefficient: ±25ppm/°C; Part Number: CPF0402B330RE1; Value: 330 Ohms; ComponentLink1Description: Datasheet; ComponentLink1URL: https://www.te.com/commerce/DocumentDelivery/DDEController?Action=srchrtrv&DocNm=1773200&DocType=DS&DocLang=English; ComponentLink2Description: DigiKey Link; ComponentLink2URL: https://www.digikey.com/en/products/detail/te-connectivity-passive-product/CPF0402B330RE1/2381792; Composition: Thin Film; Device Package: 0402 (1005 Metric); Height - Seated (Max): 0.014" (0.35mm); LastUpdated: 09-02-2024 20:30:20; Lifecycle Status: Active; Minimum Order: 1; Number of Terminations: 2; Operating Temperature: -55°C ~ 155°C; Package / Case: 0402 (1005 Metric); Packaging: TapeAndReel; PartId: 3357; Part Status: Active; Price: 0.13; Resistance: 330 Ohms; Series: CPF, Neohm; Size / Dimension: 0.039" L x 0.020" W (1.00mm x 0.50mm); Supplier 1: DigiKey; Supplier Part Number 1: A102797CT-ND; Supplier Device Package: 0402; Tolerance: ±0.1%
SC_1 = LCD__NHD-0216: Character Liquid Crystal Display Module.+5.0V INPUT Power

## Sheet Peripherals_2.SchDoc: PCB_Personal_Gif
size A4; DrawnBy: Ravi kumar dusi; SheetNumber: 3; SheetTotal: 4
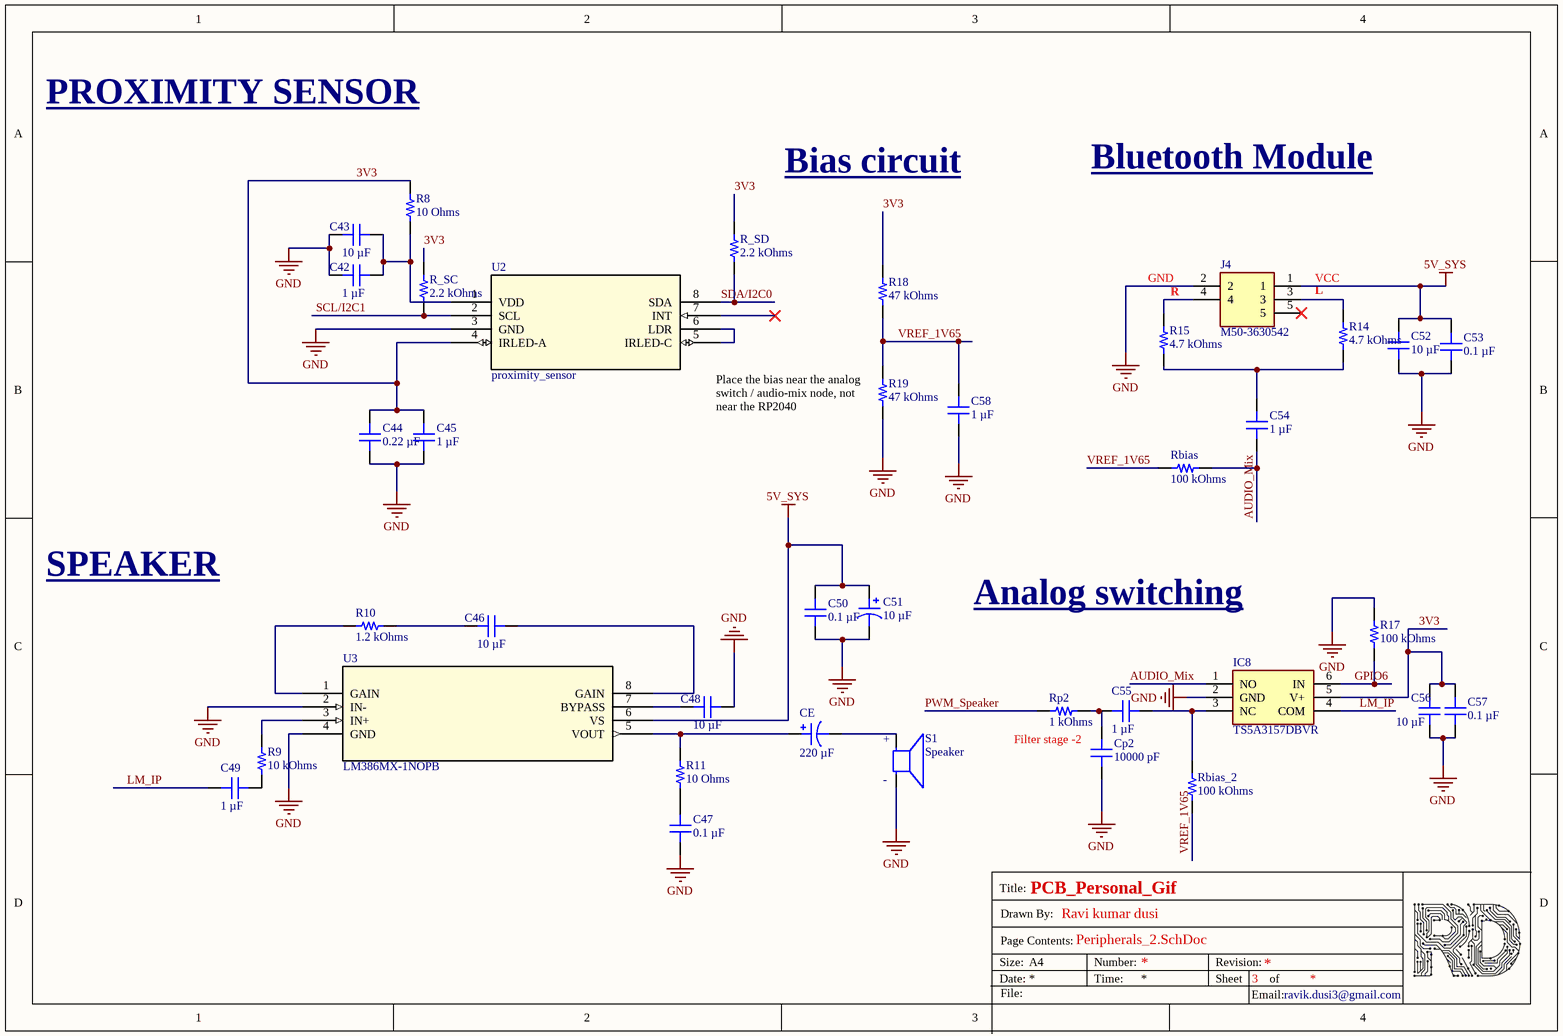
[diagram p2: Peripherals_2.SchDoc]

### Parts
C42  1 µF  [CAP 0402_1005]
C43  10 µF  [CAP 0402_1005]
C44  0.22 µF  [CAP 0402_1005]
C45  1 µF  [CAP 0402_1005]
C46  10 µF  [CAP 0402_1005]
C47  0.1 µF  [CAP 0402_1005]
C48  10 µF  [CAP 0402_1005]
C49  1 µF  [MURATA GRM155 0402_1005]
C50  0.1 µF  [CAP 0402_1005]
C51  10 µF  [CAP ALSMD 4.3MM H5.4MM]
C52  10 µF  [CAP 0402_1005]
C53  0.1 µF  [CAP 0402_1005]
C54  1 µF  [MURATA GRM155 0402_1005]
C55  1 µF  [MURATA GRM155 0402_1005]
C56  10 µF  [CAP 0402_1005]
C57  0.1 µF  [CAP 0402_1005]
C58  1 µF  [MURATA GRM155 0402_1005]
CE  220 µF  [CAP ALSMD 8.3MM H10.5MM]
Cp2  10000 pF  [CAP 0402_1005]
IC8  TS5A3157DBVR  [SOT95P280X145-6N]
J4  M50-3630542  [M503630542]
R8  10 Ohms  [RES 0402_1005]
R9  10 kOhms  [RES 0402_1005]
R10  1.2 kOhms  [RES 0402_1005]
R11  10 Ohms  [RES 0402_1005]
R14  4.7 kOhms  [YAGEO RES 0402_1005]
R15  4.7 kOhms  [YAGEO RES 0402_1005]
R17  100 kOhms  [RES 0402_1005]
R18  47 kOhms  [YAGEO RES 0402_1005]
R19  47 kOhms  [YAGEO RES 0402_1005]
R_SC  2.2 kOhms  [RES 0402_1005]
R_SD  2.2 kOhms  [RES 0402_1005]
Rbias  100 kOhms  [RES 0402_1005]
Rbias_2  100 kOhms  [RES 0402_1005]
Rp2  1 kOhms  [YAGEO RES 0402_1005]
S1  Speaker  [SPKR_AS01508MS-SC11-WP-R]
U2  proximity_sensor  [SMT_X01-GS08_VIS]
U3  LM386MX-1NOPB  [M08A_TEX]

### Nets
5V_SYS: C50.2 C51.1 C52.2 C53.2 J4.1 U3.6(VS)
GND: C42.2 C43.1 C44.1 C45.2 C47.1 C48.2 C50.1 C51.2 C52.1 C53.1 C56.1 C57.1 C58.1 Cp2.1 IC8.2(GND) J4.2 R17.2 R19.1 S1.N(NEG) U2.3(GND) U3.2(IN-) U3.4(GND)
3V3: C44.2 C45.1 C56.2 C57.2 IC8.5(V+) R8.2 R18.2 R_SC.2 R_SD.2 U2.4(IRLED-A)
AUDIO_Mix: C54.1 IC8.1(NO) Rbias.2
GPIO6: IC8.6(IN) R17.1
LM_IP: C49.1 IC8.4(COM)
PWM_Speaker: Rp2.1
SCL/I2C1: R_SC.1 U2.2(SCL)
SDA/I2C0: R_SD.1 U2.8(SDA)
VREF_1V65: C58.2 R18.1 R19.2 Rbias.1 Rbias_2.1
NetC42_1: C42.1 C43.2 R8.1 U2.1(VDD)
NetC46_1: C46.1 R10.2
NetC46_2: C46.2 U3.8(GAIN)
NetC47_2: C47.2 R11.1
NetC48_1: C48.1 U3.7(BYPASS)
NetC49_2: C49.2 R9.1
NetC54_2: C54.2 R14.1 R15.1
NetC55_1: C55.1 Cp2.2 Rp2.2
NetC55_2: C55.2 IC8.3(NC) Rbias_2.2
NetCE_1: CE.1 R11.2 U3.5(VOUT)
NetCE_2: CE.2 S1.P(POS)
NetJ4_3: J4.3 R14.2
NetJ4_4: J4.4 R15.2
NetR9_2: R9.2 U3.3(IN+)
NetR10_1: R10.1 U3.1(GAIN)
NetU2_5: U2.5(IRLED-C) U2.6(LDR)

Not connected (* = marked no-connect by the designer): J4 5*; U2 7(INT)*

### Notes on the sheet
- PROXIMITY SENSOR
- Bias circuit
- Bluetooth Module
- GND
- R
- VCC
- L
- (near R19) Place the bias near the analog switch / audio-mix node, not near the RP2040
- SPEAKER
- Analog switching
- (near Cp2) Filter stage -2
- Title:
- Drawn By:
- Size:
- Date:
- File:
- Page Contents:
- A4
- Number:
- Time:
- Revision:
- Sheet
- Email:
- of
- ravik.dusi3@gmail.com
- (in symbol Speaker) +; -

### Library data of the parts
C42 C45 C49 C54 C55 C58 = GRM155C71A105KE11D: as C14 on sheet Controller; Part Number: GRM155C71A105KE11D; Applications: General Purpose; Capacitance: 1 µF; componentlink1description: Datasheet; componentlink1url: https://search.murata.co.jp/Ceramy/image/img/A01X/G101/ENG/GRM155C71A105KE11-01.pdf; componentlink2description: DigiKey Link; componentlink2url: https://www.digikey.com/en/products/detail/murata-electronics/GRM155C71A105KE11D/6606086; Device Package: 0402 (1005 Metric); Lifecycle Status: Active; Minimum Order: 1; Mounting Type: Surface Mount, MLCC; Operating Temperature: -55°C ~ 125°C; Package / Case: 0402 (1005 Metric); packaging: TapeAndReel; partid: 1749; Part Status: Active; price: 0.01; series: GRM; Size / Dimension: 0.039" L x 0.020" W (1.00mm x 0.50mm); Supplier 1: DigiKey; Supplier Part Number 1: 490-14457-1-ND; Temperature Coefficient: X7S; Thickness (Max): 0.024" (0.60mm); Voltage - Rated: 10V
  C42 C45: Value: 1 µF; lastupdated: 09/02/2024 20:04:38
  C49 C54 C55 C58: lastupdated: 23-07-2025 10:42:36; value: 1 µF
C43 C46 C48 C52 C56 = CL05A106MP8NUB8: CAP CER 10UF 10V X5R 0402; manufacturer: Samsung Electro-Mechanics; Tolerance: ±20%; Part Number: CL05A106MP8NUB8; Applications: Acoustic Noise Reduction; Capacitance: 10 µF; componentlink1description: Datasheet; componentlink1url: http://www.samsungsem.com/kr/support/product-search/mlcc/CL05A106MP8NUB8.jsp; componentlink2description: DigiKey Link; componentlink2url: https://www.digikey.com/en/products/detail/samsung-electro-mechanics/CL05A106MP8NUB8/5961314; Device Package: 0402 (1005 Metric); Lifecycle Status: Active; Minimum Order: 1; Mounting Type: Surface Mount, MLCC; Operating Temperature: -55°C ~ 85°C; Package / Case: 0402 (1005 Metric); packaging: TapeAndReel; partid: 1758; Part Status: Active; price: 0.06; series: CL; Size / Dimension: 0.039" L x 0.020" W (1.00mm x 0.50mm); Supplier 1: DigiKey; Supplier Part Number 1: 1276-6830-1-ND; Temperature Coefficient: X5R; Thickness (Max): 0.035" (0.90mm); Voltage - Rated: 10V
  C43 C46 C48: Value: 10 µF; lastupdated: 09/02/2024 20:04:38
  C52 C56: lastupdated: 09-02-2024 20:04:38; value: 10 µF
C44 = GRM155R71C224KA12D: CAP CER 0.22UF 16V X7R 0402; manufacturer: Murata Electronics; Tolerance: ±10%; Part Number: GRM155R71C224KA12D; Value: 0.22 µF; Applications: General Purpose; Capacitance: 0.22 µF; componentlink1description: Datasheet; componentlink1url: https://www.murata.com/~/media/webrenewal/support/library/catalog/products/capacitor/mlcc/c02e.ashx?la=en-us; componentlink2description: DigiKey Link; componentlink2url: https://www.digikey.com/en/products/detail/murata-electronics/GRM155R71C224KA12D/2175204; Device Package: 0402 (1005 Metric); lastupdated: 09/02/2024 20:04:37; Lifecycle Status: Active; Minimum Order: 1; Mounting Type: Surface Mount, MLCC; Operating Temperature: -55°C ~ 125°C; Package / Case: 0402 (1005 Metric); packaging: TapeAndReel; partid: 2082; Part Status: Active; price: 0.01; series: GRM; Size / Dimension: 0.039" L x 0.020" W (1.00mm x 0.50mm); Supplier 1: DigiKey; Supplier Part Number 1: 490-5418-1-ND; Temperature Coefficient: X7R; Thickness (Max): 0.022" (0.55mm); Voltage - Rated: 16V
C47 C50 C53 C57 = C0402C104K4RECAUTO: as C15 on sheet Controller; Part Number: C0402C104K4RECAUTO; Applications: Automotive, ESD Protection; Capacitance: 0.1 µF; componentlink1description: Datasheet; componentlink1url: https://api.kemet.com/component-edge/download/datasheet/C0402C104K4RECAUTO.pdf; componentlink2description: DigiKey Link; componentlink2url: https://www.digikey.com/en/products/detail/kemet/C0402C104K4RECAUTO/8563695; Device Package: 0402 (1005 Metric); Lifecycle Status: Active; Minimum Order: 1; Mounting Type: Surface Mount, MLCC; Operating Temperature: -55°C ~ 125°C; Package / Case: 0402 (1005 Metric); packaging: TapeAndReel; partid: 1731; Part Status: Active; price: 0.01; Ratings: AEC-Q200; series: ESD SMD Auto X7R; Size / Dimension: 0.039" L x 0.020" W (1.00mm x 0.50mm); Supplier 1: DigiKey; Supplier Part Number 1: 399-17167-1-ND; Temperature Coefficient: X7R; Thickness (Max): 0.022" (0.55mm); Tolerance: ±10%; Voltage - Rated: 16V
  C47 C50: Value: 0.1 µF; lastupdated: 09/02/2024 20:04:38
  C53 C57: lastupdated: 09-02-2024 20:04:38; value: 0.1 µF
C51 = UWX1C100MCL1GB: CAP ALUM 10UF 20% 16V SMD; manufacturer: Nichicon; Lifetime @ Temp.: 2000 Hrs @ 85°C; Polarization: Polar; Ripple Current @ High Frequency: 34.5 mA @ 10 kHz; Ripple Current @ Low Frequency: 23 mA @ 120 Hz; Surface Mount Land Size: 0.169" L x 0.169" W (4.30mm x 4.30mm); Part Number: UWX1C100MCL1GB; Applications: General Purpose; Capacitance: 10 µF; componentlink1description: Datasheet; componentlink1url: https://products.nichicon.co.jp/en/pdf/XJA043/e-uwx.pdf; componentlink2description: DigiKey Link; componentlink2url: https://www.digikey.com/en/products/detail/nichicon/UWX1C100MCL1GB/589841; Device Package: Radial, Can - SMD; Height - Seated (Max): 0.213" (5.40mm); lastupdated: 03/06/2024 19:53:00; Lifecycle Status: Active; Minimum Order: 1; Mounting Type: Surface Mount; Operating Temperature: -40°C ~ 85°C; Package / Case: Radial, Can - SMD; packaging: TapeAndReel; partid: 7030; Part Status: Active; price: 0.06; series: UWX; Size / Dimension: 0.157" Dia (4.00mm); Supplier 1: DigiKey; Supplier Part Number 1: 493-2100-1-ND; Tolerance: ±20%; value: 10 µF; Voltage - Rated: 16 V
CE = EEE-FK1V221P: CAP ALUM 220UF 20% 35V SMD; manufacturer: Panasonic Electronic Components; Impedance: 160 mOhms; Lifetime @ Temp.: 2000 Hrs @ 105°C; Polarization: Polar; Ripple Current @ High Frequency: 600 mA @ 100 kHz; Ripple Current @ Low Frequency: 450 mA @ 120 Hz; Surface Mount Land Size: 0.327" L x 0.327" W (8.30mm x 8.30mm); Part Number: EEE-FK1V221P; Applications: Automotive; Capacitance: 220 µF; componentlink1description: Datasheet; componentlink1url: http://industrial.panasonic.com/www-cgi/jvcr13pz.cgi?E+PZ+3+ABA0120+EEEFK1V221P+7+WW; componentlink2description: DigiKey Link; componentlink2url: https://www.digikey.com/en/products/detail/panasonic-electronic-components/EEE-FK1V221P/766007; Device Package: Radial, Can - SMD; Height - Seated (Max): 0.413" (10.50mm); lastupdated: 03-06-2024 20:15:49; Lifecycle Status: Active; Minimum Order: 1; Mounting Type: Surface Mount; Operating Temperature: -55°C ~ 105°C; Package / Case: Radial, Can - SMD; packaging: TapeAndReel; partid: 7483; Part Status: Active; price: 0.20; Ratings: AEC-Q200; series: FK; Size / Dimension: 0.315" Dia (8.00mm); Supplier 1: DigiKey; Supplier Part Number 1: PCE3839CT-ND; Tolerance: ±20%; value: 220 µF; Voltage - Rated: 35 V
Cp2 = C0402C103M5RECAUTO: as Cp on sheet Controller; Part Number: C0402C103M5RECAUTO; Capacitance: 10000 pF; Applications: Automotive, ESD Protection; componentlink1description: Datasheet; componentlink1url: https://api.kemet.com/component-edge/download/datasheet/C0402C103M5RECAUTO.pdf; componentlink2description: DigiKey Link; componentlink2url: https://www.digikey.com/en/products/detail/kemet/C0402C103M5RECAUTO/8646509; Device Package: 0402 (1005 Metric); lastupdated: 09-02-2024 20:04:13; Lifecycle Status: Active; Minimum Order: 1; Mounting Type: Surface Mount, MLCC; Operating Temperature: -55°C ~ 125°C; Package / Case: 0402 (1005 Metric); packaging: TapeAndReel; partid: 33125; Part Status: Active; price: 0.01; Ratings: AEC-Q200; series: ESD SMD Auto X7R; Size / Dimension: 0.039" L x 0.020" W (1.00mm x 0.50mm); Supplier 1: DigiKey; Supplier Part Number 1: 399-C0402C103M5RECAUTOCT-ND; Temperature Coefficient: X7R; Thickness (Max): 0.022" (0.55mm); Tolerance: ±20%; value: 10000 pF; Voltage - Rated: 50V
IC8 = TS5A3157DBVR: Integrated Circuit; Manufacturer_Name: Texas Instruments; Datasheet Link: http://www.ti.com/general/docs/lit/getliterature.tsp?genericPartNumber=ts5a3157&fileType=pdf; Height: 1.45mm; Manufacturer_Part_Number: TS5A3157DBVR; Mouser Part Number: 595-TS5A3157DBVR; Mouser Price/Stock: https://www.mouser.co.uk/ProductDetail/Texas-Instruments/TS5A3157DBVR?qs=0O%2FZFlpUpJUE%2F9RUWXxdeQ%3D%3D; Arrow Part Number: TS5A3157DBVR; Arrow Price/Stock: https://www.arrow.com/en/products/ts5a3157dbvr/texas-instruments?utm_currency=USD&region=nac
J4 = M50-3630542: Connector; Manufacturer_Name: Harwin; Datasheet Link: https://content.harwin.com/m/6cdc14cba4152813/original/DRG-02647-Technical-Drawing-Datasheet-M50-363-pdf.pdf; Height: 4.5mm; Manufacturer_Part_Number: M50-3630542; Mouser Part Number: 855-M50-3630542; Mouser Price/Stock: https://www.mouser.co.uk/ProductDetail/Harwin/M50-3630542?qs=%252BdQmOuGyFcGTcknJK14WpQ%3D%3D
R8 R11 = ERA-2AKD100X: RES SMD 10 OHM 0.5% 1/16W 0402; Manufacturer: Panasonic Electronic Components; Power (Watts): 0.063W, 1/16W; Temperature Coefficient: ±100ppm/°C; Part Number: ERA-2AKD100X; Value: 10 Ohms; ComponentLink1Description: Datasheet; ComponentLink1URL: https://industrial.panasonic.com/cdbs/www-data/pdf/RDM0000/AOA0000C307.pdf; ComponentLink2Description: DigiKey Link; ComponentLink2URL: https://www.digikey.com/en/products/detail/panasonic-electronic-components/ERA-2AKD100X/1706054; Composition: Thin Film; Device Package: 0402 (1005 Metric); Features: Automotive AEC-Q200; Height - Seated (Max): 0.016" (0.40mm); LastUpdated: 09/02/2024 20:30:21; Lifecycle Status: Active; Minimum Order: 1; Number of Terminations: 2; Operating Temperature: -55°C ~ 155°C; Package / Case: 0402 (1005 Metric); Packaging: TapeAndReel; PartId: 3168; Part Status: Active; Price: 0.02; Ratings: AEC-Q200; Resistance: 10 Ohms; Series: ERA-2A; Size / Dimension: 0.039" L x 0.020" W (1.00mm x 0.50mm); Supplier 1: DigiKey; Supplier Part Number 1: P10DDCT-ND; Supplier Device Package: 0402; Tolerance: ±0.5%
R9 = AC0402JR-0710KL: RES SMD 10K OHM 5% 1/16W 0402; Manufacturer: Yageo; Power (Watts): 0.063W, 1/16W; Temperature Coefficient: ±100ppm/°C; Part Number: AC0402JR-0710KL; Value: 10 kOhms; ComponentLink1Description: Datasheet; ComponentLink1URL: https://www.yageo.com/upload/media/product/productsearch/datasheet/rchip/PYu-AC_51_RoHS_L_7.pdf; ComponentLink2Description: DigiKey Link; ComponentLink2URL: https://www.digikey.com/en/products/detail/yageo/AC0402JR-0710KL/5895571; Composition: Thick Film; Device Package: 0402 (1005 Metric); Features: Automotive AEC-Q200, Moisture Resistant; Height - Seated (Max): 0.015" (0.37mm); LastUpdated: 09/02/2024 20:30:20; Lifecycle Status: Active; Minimum Order: 1; Number of Terminations: 2; Operating Temperature: -55°C ~ 155°C; Package / Case: 0402 (1005 Metric); Packaging: CutTape; PartId: 3376; Part Status: Active; Price: 0.01; Ratings: AEC-Q200; Resistance: 10 kOhms; Series: AC; Size / Dimension: 0.039" L x 0.020" W (1.00mm x 0.50mm); Supplier 1: DigiKey; Supplier Part Number 1: YAG3517CT-ND; Supplier Device Package: 0402; Tolerance: ±5%
R10 = RR0510P-122-D: RES SMD 1.2K OHM 0.5% 1/16W 0402; Manufacturer: Susumu; Power (Watts): 0.063W, 1/16W; Temperature Coefficient: ±25ppm/°C; Part Number: RR0510P-122-D; Value: 1.2 kOhms; ComponentLink1Description: Datasheet; ComponentLink1URL: http://www.susumu.co.jp/common/pdf/n_catalog_partition05_en.pdf; ComponentLink2Description: DigiKey Link; ComponentLink2URL: https://www.digikey.com/en/products/detail/susumu/RR0510P-122-D/432399; Composition: Thin Film; Device Package: 0402 (1005 Metric); Height - Seated (Max): 0.016" (0.40mm); LastUpdated: 09/02/2024 20:30:21; Lifecycle Status: Active; Minimum Order: 1; Number of Terminations: 2; Operating Temperature: -55°C ~ 125°C; Package / Case: 0402 (1005 Metric); Packaging: TapeAndReel; PartId: 3223; Part Status: Active; Price: 0.01; Resistance: 1.2 kOhms; Series: RR; Size / Dimension: 0.039" L x 0.020" W (1.00mm x 0.50mm); Supplier 1: DigiKey; Supplier Part Number 1: RR05P1.2KDCT-ND; Tolerance: ±0.5%
R14 R15 = RT0402FRE074K7L: RES SMD 4.7K OHM 1% 1/16W 0402; Manufacturer: Yageo; Power (Watts): 0.063W, 1/16W; Temperature Coefficient: ±50ppm/°C; Part Number: RT0402FRE074K7L; Value: 4.7 kOhms; ComponentLink1Description: Datasheet; ComponentLink1URL: https://www.yageo.com/upload/media/product/productsearch/datasheet/rchip/PYu-RT_1-to-0.01_RoHS_L_11.pdf; ComponentLink2Description: DigiKey Link; ComponentLink2URL: https://www.digikey.com/en/products/detail/yageo/RT0402FRE074K7L/1072052; Composition: Thin Film; Device Package: 0402 (1005 Metric); Height - Seated (Max): 0.014" (0.35mm); LastUpdated: 31-08-2025 15:04:17; Lifecycle Status: Active; Minimum Order: 1; Number of Terminations: 2; Operating Temperature: -55°C ~ 155°C; Package / Case: 0402 (1005 Metric); Packaging: TapeAndReel; PartId: 3198; Part Status: Active; Price: 0.01; Resistance: 4.7 kOhms; Series: RT; Size / Dimension: 0.039" L x 0.020" W (1.00mm x 0.50mm); Supplier 1: DigiKey; Supplier Part Number 1: YAG3347CT-ND; Supplier Device Package: 0402; Tolerance: ±1%
R17 Rbias Rbias_2 = RP73PF1E100KBTD: RES 100K OHM 0.1% 1/10W 0402; Manufacturer: TE Connectivity Passive Product; Power (Watts): 0.1W, 1/10W; Temperature Coefficient: ±25ppm/°C; Part Number: RP73PF1E100KBTD; Value: 100 kOhms; ComponentLink1Description: Datasheet; ComponentLink1URL: https://www.te.com/commerce/DocumentDelivery/DDEController?Action=srchrtrv&DocNm=1773272&DocType=DS&DocLang=English; ComponentLink2Description: DigiKey Link; ComponentLink2URL: https://www.digikey.com/en/products/detail/te-connectivity-passive-product/RP73PF1E100KBTD/8261053; Composition: Thin Film; Device Package: 0402 (1005 Metric); Height - Seated (Max): 0.014" (0.35mm); LastUpdated: 09-02-2024 20:30:24; Lifecycle Status: Active; Minimum Order: 1; Number of Terminations: 2; Operating Temperature: -55°C ~ 155°C; Package / Case: 0402 (1005 Metric); Packaging: TapeAndReel; PartId: 2436; Part Status: Active; Price: 0.08; Resistance: 100 kOhms; Series: RP73, Holsworthy; Size / Dimension: 0.039" L x 0.020" W (1.00mm x 0.50mm); Supplier 1: DigiKey; Supplier Part Number 1: A127511CT-ND; Supplier Device Package: 0402; Tolerance: ±0.1%
R18 R19 = AC0402JR-0747KL: RES SMD 47K OHM 5% 1/16W 0402; Manufacturer: Yageo; Power (Watts): 0.063W, 1/16W; Temperature Coefficient: ±100ppm/°C; Part Number: AC0402JR-0747KL; Value: 47 kOhms; ComponentLink1Description: Datasheet; ComponentLink1URL: https://www.yageo.com/upload/media/product/productsearch/datasheet/rchip/PYu-AC_51_RoHS_L_7.pdf; ComponentLink2Description: DigiKey Link; ComponentLink2URL: https://www.digikey.com/en/products/detail/yageo/AC0402JR-0747KL/5895679; Composition: Thick Film; Device Package: 0402 (1005 Metric); Features: Automotive AEC-Q200, Moisture Resistant; Height - Seated (Max): 0.015" (0.37mm); LastUpdated: 31-08-2025 15:04:17; Lifecycle Status: Active; Minimum Order: 1; Number of Terminations: 2; Operating Temperature: -55°C ~ 155°C; Package / Case: 0402 (1005 Metric); Packaging: CutTape; PartId: 3385; Part Status: Active; Price: 0.01; Ratings: AEC-Q200; Resistance: 47 kOhms; Series: AC; Size / Dimension: 0.039" L x 0.020" W (1.00mm x 0.50mm); Supplier 1: DigiKey; Supplier Part Number 1: YAG3547CT-ND; Supplier Device Package: 0402; Tolerance: ±5%
R_SC R_SD = TNPW04022K20BYEP: RES 2.2K OHM 0.1% 1/16W 0402; Manufacturer: Vishay Dale; Power (Watts): 0.063W, 1/16W; Temperature Coefficient: ±10ppm/°C; Part Number: TNPW04022K20BYEP; Value: 2.2 kOhms; ComponentLink1Description: Datasheet; ComponentLink1URL: http://www.vishay.com/docs/28758/tnpw_e3.pdf; ComponentLink2Description: DigiKey Link; ComponentLink2URL: https://www.digikey.com/en/products/detail/vishay-dale/TNPW04022K20BYEP/8636618; Composition: Thin Film; Device Package: 0402 (1005 Metric); Features: Anti-Sulfur, Automotive AEC-Q200, Moisture Resistant; Height - Seated (Max): 0.016" (0.40mm); LastUpdated: 09-02-2024 20:30:21; Lifecycle Status: Active; Minimum Order: 1; Number of Terminations: 2; Operating Temperature: -55°C ~ 155°C; Package / Case: 0402 (1005 Metric); Packaging: TapeAndReel; PartId: 3077; Part Status: Active; Price: 0.25; Ratings: AEC-Q200; Resistance: 2.2 kOhms; Series: TNPW e3; Size / Dimension: 0.039" L x 0.020" W (1.00mm x 0.50mm); Supplier 1: DigiKey; Supplier Part Number 1: 541-9805-1-ND; Supplier Device Package: 0402; Tolerance: ±0.1%
Rp2 = AT0402BRD071KL: as Rp on sheet Controller; Part Number: AT0402BRD071KL; Value: 1 kOhms; ComponentLink1Description: Datasheet; ComponentLink1URL: http://www.yageo.com/documents/recent/PYu-AT_51_RoHS_L_5.pdf; ComponentLink2Description: DigiKey Link; ComponentLink2URL: https://www.digikey.com/en/products/detail/yageo/AT0402BRD071KL/5138607; Composition: Thin Film; Device Package: 0402 (1005 Metric); Features: Anti-Sulfur, Automotive AEC-Q200, Moisture Resistant; Height - Seated (Max): 0.014" (0.35mm); LastUpdated: 31-08-2025 15:04:18; Lifecycle Status: Active; Minimum Order: 1; Number of Terminations: 2; Operating Temperature: -55°C ~ 155°C; Package / Case: 0402 (1005 Metric); Packaging: TapeAndReel; PartId: 2462; Part Status: Active; Price: 0.09; Ratings: AEC-Q200; Resistance: 1 kOhms; Series: AT; Size / Dimension: 0.039" L x 0.020" W (1.00mm x 0.50mm); Supplier 1: DigiKey; Supplier Part Number 1: YAG2088CT-ND; Supplier Device Package: 0402; Tolerance: ±0.1%
S1 = Speaker: AS01508MS-SC11-WP-R speaker,0.7 INPUT PWR, 60-20K dB frequency.
U2 = proximity_sensor: Proximity Sensors INTEGRATED PROXIMITY + IR LED.
U3 = LM386MX-1NOPB: IC AMP CLASS AB MONO 325MW 8SOIC.AUDIO AMPLIFIER; Mfr_Name: Texas Instruments; RefDes: RefDes; Type: Type